# Altium schematic sheet IMX6ULL_CORE_sch6.SchDoc
size A4
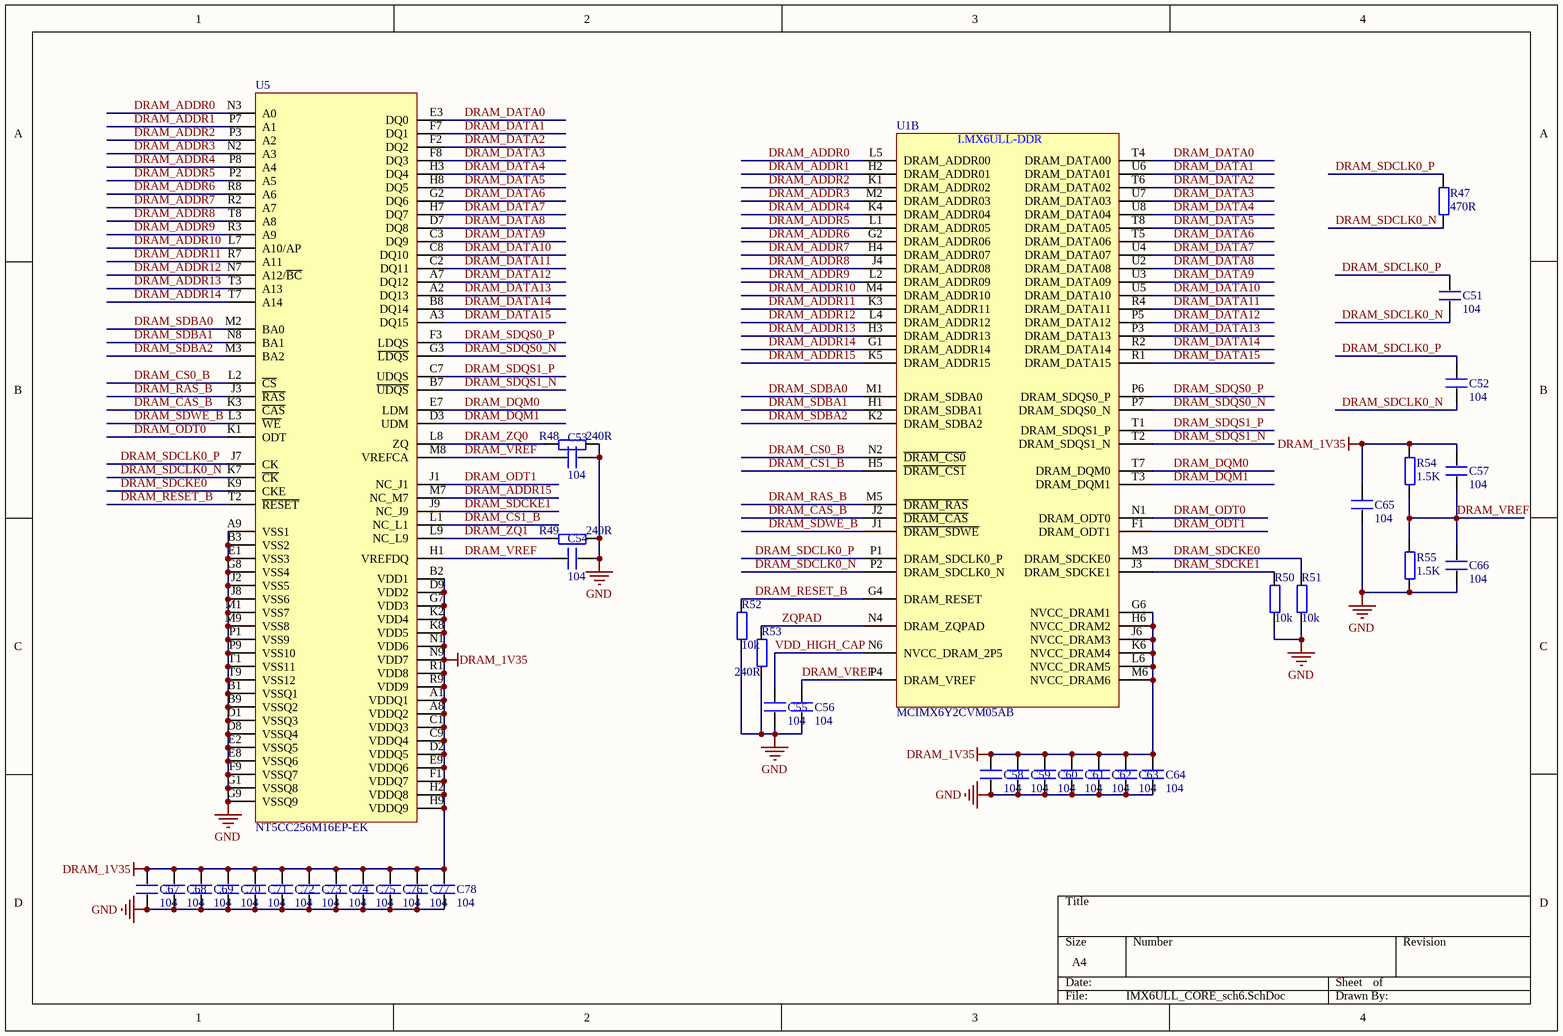
[diagram p0: IMX6ULL_CORE_sch6.SchDoc]

## Parts
C51  104  [C 0402]
C52  104  [C 0402]
C53  104  [C 0402]
C54  104  [C 0402]
C55  104  [C 0402]
C56  104  [C 0402]
C57  104  [C 0402]
C58  104  [C 0402]
C59  104  [C 0402]
C60  104  [C 0402]
C61  104  [C 0402]
C62  104  [C 0402]
C63  104  [C 0402]
C64  104  [C 0402]
C65  104  [C 0402]
C66  104  [C 0402]
C67  104  [C 0402]
C68  104  [C 0402]
C69  104  [C 0402]
C70  104  [C 0402]
C71  104  [C 0402]
C72  104  [C 0402]
C73  104  [C 0402]
C74  104  [C 0402]
C75  104  [C 0402]
C76  104  [C 0402]
C77  104  [C 0402]
C78  104  [C 0402]
R47  470R  [R 0402]
R48  240R  [R 0402]
R49  240R  [R 0402]
R50  10k  [R 0402]
R51  10k  [R 0402]
R52  10k  [R 0402]
R53  240R  [R 0402]
R54  1.5K  [R 0402]
R55  1.5K  [R 0402]
U1  MCIMX6Y2CVM05AB  [BGA289C80P17X17_1400X1400X132]  (part B of 5)
U5  NT5CC256M16EP-EK  [BGA96]

## Nets
DRAM_1V35: C57.2 C58.2 C59.2 C60.2 C61.2 C62.2 C63.2 C64.2 C65.2 C67.2 C68.2 C69.2 C70.2 C71.2 C72.2 C73.2 C74.2 C75.2 C76.2 C77.2 C78.2 R54.2 U1.G6(NVCC_DRAM1) U1.H6(NVCC_DRAM2) U1.J6(NVCC_DRAM3) U1.K6(NVCC_DRAM4) U1.L6(NVCC_DRAM5) U1.M6(NVCC_DRAM6) U5.A1(VDDQ1) U5.A8(VDDQ2) U5.B2(VDD1) U5.C1(VDDQ3) U5.C9(VDDQ4) U5.D2(VDDQ5) U5.D9(VDD2) U5.E9(VDDQ6) U5.F1(VDDQ7) U5.G7(VDD3) U5.H2(VDDQ8) U5.H9(VDDQ9) U5.K2(VDD4) U5.K8(VDD5) U5.N1(VDD6) U5.N9(VDD7) U5.R1(VDD8) U5.R9(VDD9)
GND: C53.2 C54.2 C55.1 C56.1 C58.1 C59.1 C60.1 C61.1 C62.1 C63.1 C64.1 C65.1 C66.1 C67.1 C68.1 C69.1 C70.1 C71.1 C72.1 C73.1 C74.1 C75.1 C76.1 C77.1 C78.1 R48.2 R49.2 R50.1 R51.1 R52.1 R53.1 R55.1 U5.A9(VSS1) U5.B1(VSSQ1) U5.B3(VSS2) U5.B9(VSSQ2) U5.D1(VSSQ3) U5.D8(VSSQ4) U5.E1(VSS3) U5.E2(VSSQ5) U5.E8(VSSQ6) U5.F9(VSSQ7) U5.G1(VSSQ8) U5.G8(VSS4) U5.G9(VSSQ9) U5.J2(VSS5) U5.J8(VSS6) U5.M1(VSS7) U5.M9(VSS8) U5.P1(VSS9) U5.P9(VSS10) U5.T1(VSS11) U5.T9(VSS12)
DRAM_ADDR0: U1.L5(DRAM_ADDR00) U5.N3(A0)
DRAM_ADDR1: U1.H2(DRAM_ADDR01) U5.P7(A1)
DRAM_ADDR2: U1.K1(DRAM_ADDR02) U5.P3(A2)
DRAM_ADDR3: U1.M2(DRAM_ADDR03) U5.N2(A3)
DRAM_ADDR4: U1.K4(DRAM_ADDR04) U5.P8(A4)
DRAM_ADDR5: U1.L1(DRAM_ADDR05) U5.P2(A5)
DRAM_ADDR6: U1.G2(DRAM_ADDR06) U5.R8(A6)
DRAM_ADDR7: U1.H4(DRAM_ADDR07) U5.R2(A7)
DRAM_ADDR8: U1.J4(DRAM_ADDR08) U5.T8(A8)
DRAM_ADDR9: U1.L2(DRAM_ADDR09) U5.R3(A9)
DRAM_ADDR10: U1.M4(DRAM_ADDR10) U5.L7(A10/AP)
DRAM_ADDR11: U1.K3(DRAM_ADDR11) U5.R7(A11)
DRAM_ADDR12: U1.L4(DRAM_ADDR12) U5.N7(A12/~{BC})
DRAM_ADDR13: U1.H3(DRAM_ADDR13) U5.T3(A13)
DRAM_ADDR14: U1.G1(DRAM_ADDR14) U5.T7(A14)
DRAM_ADDR15: U1.K5(DRAM_ADDR15) U5.M7(NC_M7)
DRAM_CAS_B: U1.J2(~{DRAM_CAS}) U5.K3(~{CAS})
DRAM_CS0_B: U1.N2(~{DRAM_CS0}) U5.L2(~{CS})
DRAM_CS1_B: U1.H5(~{DRAM_CS1}) U5.L1(NC_L1)
DRAM_DATA0: U1.T4(DRAM_DATA00) U5.E3(DQ0)
DRAM_DATA1: U1.U6(DRAM_DATA01) U5.F7(DQ1)
DRAM_DATA2: U1.T6(DRAM_DATA02) U5.F2(DQ2)
DRAM_DATA3: U1.U7(DRAM_DATA03) U5.F8(DQ3)
DRAM_DATA4: U1.U8(DRAM_DATA04) U5.H3(DQ4)
DRAM_DATA5: U1.T8(DRAM_DATA05) U5.H8(DQ5)
DRAM_DATA6: U1.T5(DRAM_DATA06) U5.G2(DQ6)
DRAM_DATA7: U1.U4(DRAM_DATA07) U5.H7(DQ7)
DRAM_DATA8: U1.U2(DRAM_DATA08) U5.D7(DQ8)
DRAM_DATA9: U1.U3(DRAM_DATA09) U5.C3(DQ9)
DRAM_DATA10: U1.U5(DRAM_DATA10) U5.C8(DQ10)
DRAM_DATA11: U1.R4(DRAM_DATA11) U5.C2(DQ11)
DRAM_DATA12: U1.P5(DRAM_DATA12) U5.A7(DQ12)
DRAM_DATA13: U1.P3(DRAM_DATA13) U5.A2(DQ13)
DRAM_DATA14: U1.R2(DRAM_DATA14) U5.B8(DQ14)
DRAM_DATA15: U1.R1(DRAM_DATA15) U5.A3(DQ15)
DRAM_DQM0: U1.T7(DRAM_DQM0) U5.E7(LDM)
DRAM_DQM1: U1.T3(DRAM_DQM1) U5.D3(UDM)
DRAM_ODT0: U1.N1(DRAM_ODT0) U5.K1(ODT)
DRAM_ODT1: U1.F1(DRAM_ODT1) U5.J1(NC_J1)
DRAM_RAS_B: U1.M5(~{DRAM_RAS}) U5.J3(~{RAS})
DRAM_RESET_B: R52.2 U1.G4(DRAM_RESET) U5.T2(~{RESET})
DRAM_SDBA0: U1.M1(DRAM_SDBA0) U5.M2(BA0)
DRAM_SDBA1: U1.H1(DRAM_SDBA1) U5.N8(BA1)
DRAM_SDBA2: U1.K2(DRAM_SDBA2) U5.M3(BA2)
DRAM_SDCKE0: R51.2 U1.M3(DRAM_SDCKE0) U5.K9(CKE)
DRAM_SDCKE1: R50.2 U1.J3(DRAM_SDCKE1) U5.J9(NC_J9)
DRAM_SDCLK0_N: C51.1 C52.1 R47.1 U1.P2(DRAM_SDCLK0_N) U5.K7(~{CK})
DRAM_SDCLK0_P: C51.2 C52.2 R47.2 U1.P1(DRAM_SDCLK0_P) U5.J7(CK)
DRAM_SDQS0_N: U1.P7(DRAM_SDQS0_N) U5.G3(~{LDQS})
DRAM_SDQS0_P: U1.P6(DRAM_SDQS0_P) U5.F3(LDQS)
DRAM_SDQS1_N: U1.T2(DRAM_SDQS1_N) U5.B7(~{UDQS})
DRAM_SDQS1_P: U1.T1(DRAM_SDQS1_P) U5.C7(UDQS)
DRAM_SDWE_B: U1.J1(~{DRAM_SDWE}) U5.L3(~{WE})
DRAM_VREF: C53.1 C54.1 C56.2 C57.1 C66.2 R54.1 R55.2 U1.P4(DRAM_VREF) U5.H1(VREFDQ) U5.M8(VREFCA)
DRAM_ZQ0: R48.1 U5.L8(ZQ)
DRAM_ZQ1: R49.1 U5.L9(NC_L9)
VDD_HIGH_CAP: C55.2 U1.N6(NVCC_DRAM_2P5)
ZQPAD: R53.2 U1.N4(DRAM_ZQPAD)

## Notes on the sheet
- (in symbol MCIMX6Y2CVM05AB, part B) I.MX6ULL-DDR

## Library data of the parts
C51-C78 = C
R47-R55 = R
U5 = MT41K256M16TW